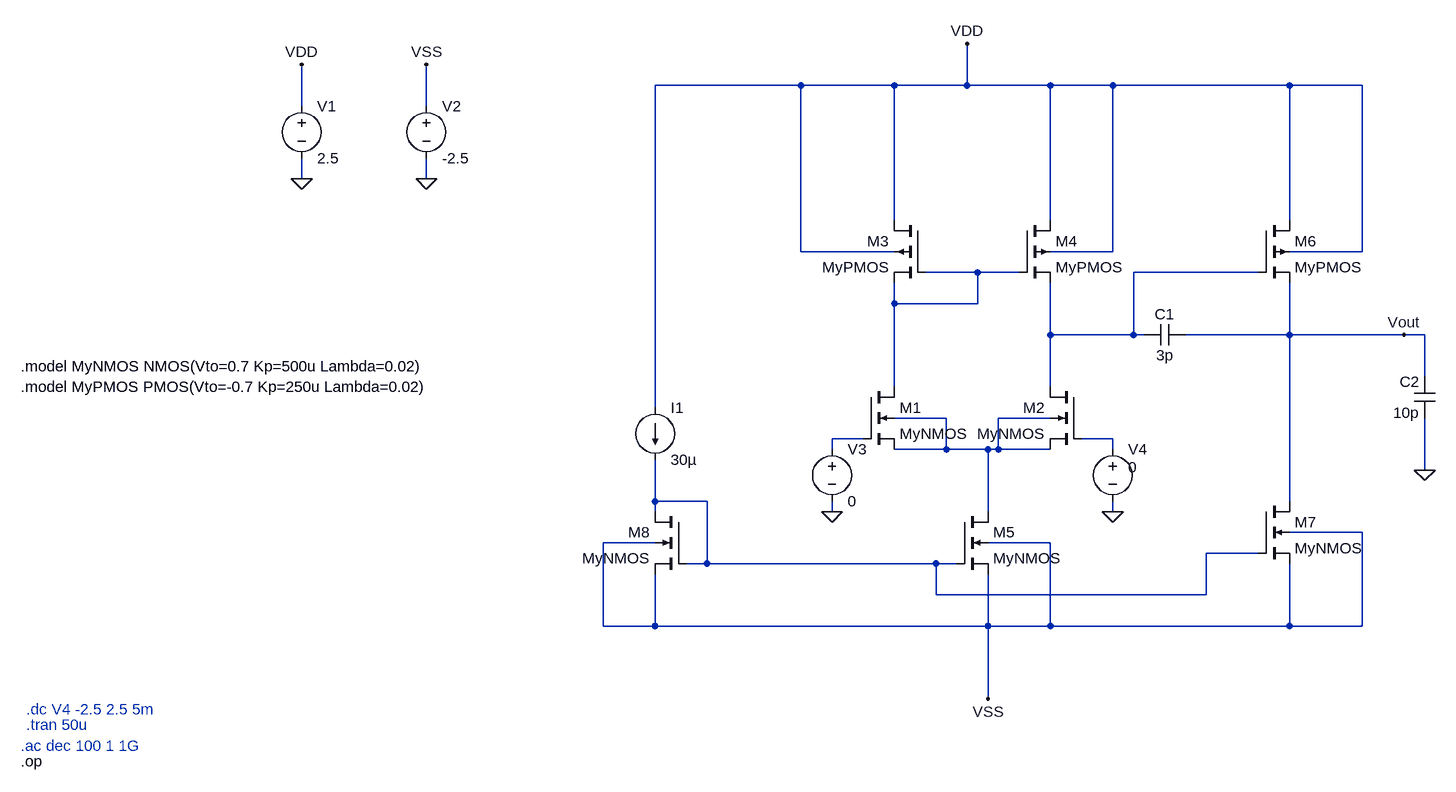
[diagram p0: schematic Draft4.asc]
Draft4.asc, the LTspice schematic file:
Version 4.1
SHEET 1 880 688
WIRE -736 -368 -960 -368
WIRE -592 -368 -736 -368
WIRE -480 -368 -480 -432
WIRE -480 -368 -592 -368
WIRE -352 -368 -480 -368
WIRE -256 -368 -352 -368
WIRE 16 -368 -256 -368
WIRE 128 -368 16 -368
WIRE -1504 -336 -1504 -400
WIRE -1312 -336 -1312 -400
WIRE -1504 -224 -1504 -256
WIRE -1312 -224 -1312 -256
WIRE -592 -160 -592 -368
WIRE -352 -160 -352 -368
WIRE 16 -160 16 -368
WIRE -736 -112 -736 -368
WIRE -592 -112 -736 -112
WIRE -256 -112 -256 -368
WIRE -256 -112 -352 -112
WIRE 128 -112 128 -368
WIRE 128 -112 16 -112
WIRE -464 -80 -544 -80
WIRE -400 -80 -464 -80
WIRE -32 -80 -224 -80
WIRE -592 -32 -592 -64
WIRE -464 -32 -464 -80
WIRE -464 -32 -592 -32
WIRE -352 16 -352 -64
WIRE -224 16 -224 -80
WIRE -224 16 -352 16
WIRE -208 16 -224 16
WIRE 16 16 16 -64
WIRE 16 16 -144 16
WIRE 192 16 16 16
WIRE 224 16 192 16
WIRE 224 80 224 16
WIRE -592 96 -592 -32
WIRE -352 96 -352 16
WIRE -960 128 -960 -368
WIRE -512 144 -592 144
WIRE -352 144 -432 144
WIRE -640 176 -688 176
WIRE -256 176 -304 176
WIRE -688 192 -688 176
WIRE -512 192 -512 144
WIRE -512 192 -592 192
WIRE -448 192 -512 192
WIRE -432 192 -432 144
WIRE -432 192 -448 192
WIRE -352 192 -432 192
WIRE -256 192 -256 176
WIRE 224 224 224 144
WIRE -960 272 -960 208
WIRE -880 272 -960 272
WIRE 16 272 16 16
WIRE -960 288 -960 272
WIRE -688 288 -688 272
WIRE -448 288 -448 192
WIRE -256 288 -256 272
WIRE 128 320 16 320
WIRE -960 336 -1040 336
WIRE -352 336 -448 336
WIRE -32 352 -112 352
WIRE -880 368 -880 272
WIRE -880 368 -912 368
WIRE -528 368 -880 368
WIRE -496 368 -528 368
WIRE -528 416 -528 368
WIRE -112 416 -112 352
WIRE -112 416 -528 416
WIRE -1040 464 -1040 336
WIRE -960 464 -960 384
WIRE -960 464 -1040 464
WIRE -448 464 -448 384
WIRE -448 464 -960 464
WIRE -352 464 -352 336
WIRE -352 464 -448 464
WIRE 16 464 16 368
WIRE 16 464 -352 464
WIRE 128 464 128 320
WIRE 128 464 16 464
WIRE -448 576 -448 464
FLAG 224 224 0
FLAG -1504 -224 0
FLAG -1312 -224 0
FLAG -1504 -400 VDD
FLAG -480 -432 VDD
FLAG -1312 -400 VSS
FLAG -448 576 VSS
FLAG 192 16 Vout
FLAG -688 288 0
FLAG -256 288 0
SYMBOL current -960 128 R0
WINDOW 123 0 0 Left 0
WINDOW 39 0 0 Left 0
SYMATTR InstName I1
SYMATTR Value 30µ
SYMBOL cap -144 0 R90
WINDOW 0 0 32 VBottom 2
WINDOW 3 32 32 VTop 2
SYMATTR InstName C1
SYMATTR Value 3p
SYMBOL cap 240 144 R180
WINDOW 0 24 56 Left 2
WINDOW 3 24 8 Left 2
SYMATTR InstName C2
SYMATTR Value 10p
SYMBOL voltage -1504 -352 R0
WINDOW 123 0 0 Left 0
WINDOW 39 0 0 Left 0
SYMATTR InstName V1
SYMATTR Value 2.5
SYMBOL voltage -1312 -352 R0
WINDOW 123 0 0 Left 0
WINDOW 39 0 0 Left 0
SYMATTR InstName V2
SYMATTR Value -2.5
SYMBOL nmos4 -640 96 R0
SYMATTR InstName M1
SYMATTR Value MyNMOS
SYMATTR Value2 l=1u w=2.37u
SYMBOL nmos4 -304 96 M0
SYMATTR InstName M2
SYMATTR Value MyNMOS
SYMATTR Value2 l=1u w=2.37u
SYMBOL pmos4 -544 -160 M0
SYMATTR InstName M3
SYMATTR Value MyPMOS
SYMATTR Value2 l=1u w=3u
SYMBOL pmos4 -400 -160 R0
SYMATTR InstName M4
SYMATTR Value MyPMOS
SYMATTR Value2 l=1u w=3u
SYMBOL nmos4 -496 288 R0
SYMATTR InstName M5
SYMATTR Value MyNMOS
SYMATTR Value2 l=1u w=3u
SYMBOL pmos4 -32 -160 R0
SYMATTR InstName M6
SYMATTR Value MyPMOS
SYMATTR Value2 l=1u w=83u
SYMBOL nmos4 -32 272 R0
SYMATTR InstName M7
SYMATTR Value MyNMOS
SYMATTR Value2 l=1u w=7u
SYMBOL nmos4 -912 288 M0
SYMATTR InstName M8
SYMATTR Value MyNMOS
SYMATTR Value2 l=1u w=3u
SYMBOL voltage -688 176 R0
WINDOW 123 24 124 Left 2
WINDOW 39 0 0 Left 0
SYMATTR InstName V3
SYMATTR Value 0
SYMBOL voltage -256 176 R0
WINDOW 123 24 124 Left 2
WINDOW 39 0 0 Left 0
WINDOW 3 24 44 Left 2
SYMATTR Value 0
SYMATTR InstName V4
TEXT -1936 64 Left 2 !.model MyNMOS NMOS(Vto=0.7 Kp=500u Lambda=0.02)
TEXT -1936 96 Left 2 !.model MyPMOS PMOS(Vto=-0.7 Kp=250u Lambda=0.02)
TEXT -1936 672 Left 2 !.op
TEXT -1936 648 Left 2 ;.ac dec 100 1 1G
TEXT -1928 616 Left 2 ;.tran 50u
TEXT -1928 592 Left 2 ;.dc V4 -2.5 2.5 5m

The netlist it stands for:
* Draft4.asc
I1 VDD N006 30µ
C1 Vout N002 3p
C2 0 Vout 10p
V1 VDD 0 2.5
V2 VSS 0 -2.5
M1 N001 N004 N003 N003 MyNMOS l=1u w=2.37u
M2 N002 N005 N003 N003 MyNMOS l=1u w=2.37u
M3 VDD N001 N001 VDD MyPMOS l=1u w=3u
M4 VDD N001 N002 VDD MyPMOS l=1u w=3u
M5 N003 N006 VSS VSS MyNMOS l=1u w=3u
M6 VDD N002 Vout VDD MyPMOS l=1u w=83u
M7 Vout N006 VSS VSS MyNMOS l=1u w=7u
M8 N006 N006 VSS VSS MyNMOS l=1u w=3u
V3 N004 0 0
V4 N005 0 0
.model NMOS NMOS
.model PMOS PMOS
.lib standard.mos
.model MyNMOS NMOS(Vto=0.7 Kp=500u Lambda=0.02)
.model MyPMOS PMOS(Vto=-0.7 Kp=250u Lambda=0.02)
.op
* .ac dec 100 1 1G
* .tran 50u
* .dc V4 -2.5 2.5 5m
.backanno
.end